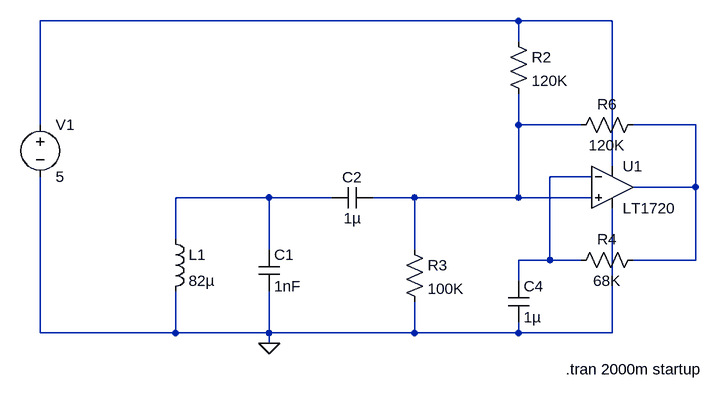
[diagram p0: schematic Oscillator_LT1720_1uF.asc]
Oscillator_LT1720_1uF.asc, the LTspice schematic file:
Version 4
SHEET 1 880 776
WIRE 160 80 -576 80
WIRE 304 80 160 80
WIRE 160 112 160 80
WIRE -576 240 -576 80
WIRE 160 240 160 192
WIRE 256 240 160 240
WIRE 432 240 336 240
WIRE 304 304 304 80
WIRE 272 320 208 320
WIRE 432 336 432 240
WIRE 432 336 336 336
WIRE -224 352 -368 352
WIRE -128 352 -224 352
WIRE 0 352 -64 352
WIRE 160 352 160 240
WIRE 160 352 0 352
WIRE 272 352 160 352
WIRE -368 416 -368 352
WIRE -224 432 -224 352
WIRE 0 432 0 352
WIRE 208 448 208 320
WIRE 208 448 160 448
WIRE 256 448 208 448
WIRE 432 448 432 336
WIRE 432 448 336 448
WIRE 160 480 160 448
WIRE -576 560 -576 320
WIRE -368 560 -368 496
WIRE -368 560 -576 560
WIRE -224 560 -224 496
WIRE -224 560 -368 560
WIRE 0 560 0 512
WIRE 0 560 -224 560
WIRE 160 560 160 544
WIRE 160 560 0 560
WIRE 304 560 304 368
WIRE 304 560 160 560
WIRE -224 576 -224 560
FLAG -224 576 0
SYMBOL Res 144 96 R0
SYMATTR InstName R2
SYMATTR Value 120K
SYMBOL ind -384 400 R0
SYMATTR InstName L1
SYMATTR Value 82µ
SYMBOL Cap -240 432 R0
SYMATTR InstName C1
SYMATTR Value 1nF
SYMBOL cap -64 336 R90
WINDOW 0 0 32 VBottom 2
WINDOW 3 32 32 VTop 2
SYMATTR InstName C2
SYMATTR Value 1µ
SYMBOL Res -16 416 R0
SYMATTR InstName R3
SYMATTR Value 100K
SYMBOL Res 352 432 R90
WINDOW 0 0 56 VBottom 2
WINDOW 3 32 56 VTop 2
SYMATTR InstName R4
SYMATTR Value 68K
SYMBOL Cap 144 480 R0
SYMATTR InstName C4
SYMATTR Value 1µ
SYMBOL Res 352 224 R90
WINDOW 0 0 56 VBottom 2
WINDOW 3 32 56 VTop 2
SYMATTR InstName R6
SYMATTR Value 120K
SYMBOL voltage -576 224 R0
SYMATTR InstName V1
SYMATTR Value 5
SYMBOL LT1720 304 272 R0
SYMATTR InstName U1
TEXT 232 616 Left 2 !.tran 2000m startup

The netlist it stands for:
* Oscillator_LT1720_1uF.asc
R2 N001 N002 120K
L1 N005 0 82µ
C1 N005 0 1nF
C2 N002 N005 1µ
R3 N002 0 100K
R4 N003 N004 68K
C4 N004 0 1µ
R6 N003 N002 120K
V1 N001 0 5
XU1 N002 N004 N001 0 N003 LT1720  ; pins In+ In- V+ V- OUT
.tran 2000m startup
.lib LT1720.sub
.backanno
.end